# Altium project FPGA_POETIC.PrjPcb (part 2 of 2)
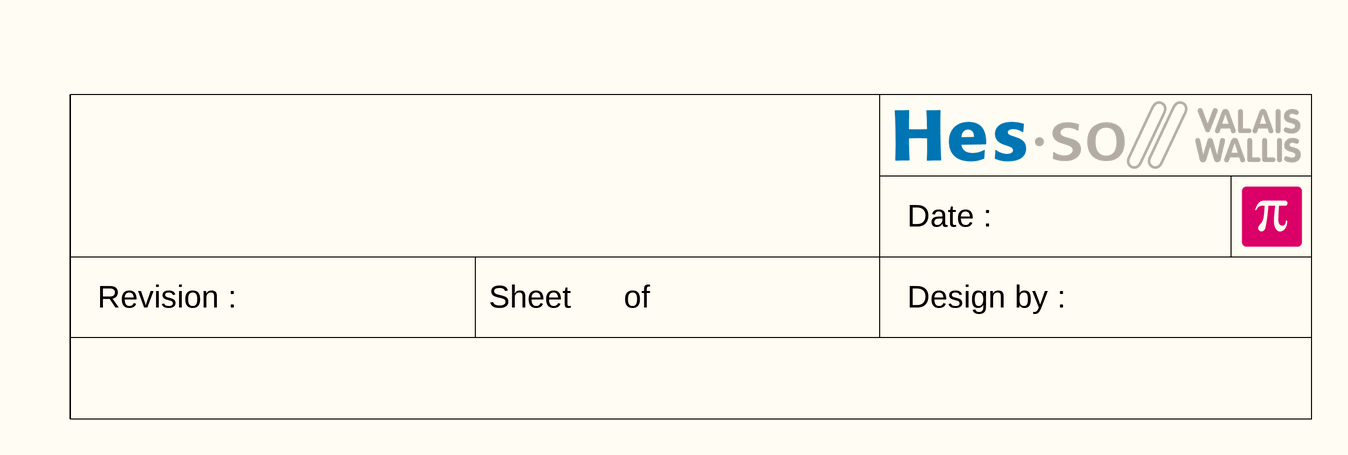
[diagram p10: UserInterface_0.SchDoc, right]

## Nets that join several sheets
+1.2V_CORE: FPGA_1 (31 pins), Supply_0 (R62.2 TP5.1)
+3V3_BACKPLANE: Connector_0 (6 pins), Supply_0 (7 pins)
+3V3_D: FPGA_0 (R26.2 R29.2 R57.2), FPGA_1 (99 pins), Connector_0 (13 pins), Supply_0 (J8.2 TP6.1), UserInterface_0 (7 pins)
+5V_MEZZA: Connector_0 (J2.a25 J11.a25), Supply_0 (J7.2 TP1.1)
+5V_USB: Connector_0 (C79.2 C80.2 R7.2 U1.19), Supply_0 (6 pins)
GND_D: FPGA_0 (R27.1 R28.1 R56.1), FPGA_1 (115 pins), Connector_0 (61 pins), Supply_0 (15 pins), UserInterface_0 (14 pins)
~{SPIA_STE}: FPGA_0 (U2.AB17), Connector_0 (J1.b12 J10.b12)
~{SPIB_STE}: FPGA_0 (U2.AB11), Connector_0 (J1.b8 J10.b8)
~{SPIC_STE}: FPGA_0 (U2.AA4), Connector_0 (J1.b2 J10.b2)
ADC_CH0_CS: FPGA_0 (U2.F15), Connector_0 (J1.b25 J10.b25)
ADC_CH0_SDO: FPGA_0 (U2.H14), Connector_0 (J1.b23 J10.b23)
ADC_CH1_CS: FPGA_0 (U2.A15), Connector_0 (J2.b22 J11.b22)
ADC_CH1_SDO: FPGA_0 (U2.A14), Connector_0 (J2.b21 J11.b21)
ADC_CH2_CS: FPGA_0 (U2.B12), Connector_0 (J2.b20 J11.b20)
ADC_CH2_SDO: FPGA_0 (U2.C17), Connector_0 (J2.b19 J11.b19)
ADC_CH3_CS: FPGA_0 (U2.A18), Connector_0 (J2.b24 J11.b24)
ADC_CH3_SDO: FPGA_0 (U2.B16), Connector_0 (J2.b23 J11.b23)
ADC_CH4_CS: FPGA_0 (U2.C16), Connector_0 (J2.b18 J11.b18)
ADC_CH4_SDO: FPGA_0 (U2.C15), Connector_0 (J2.b16 J11.b16)
ADC_CH5_CS: FPGA_0 (U2.B6), Connector_0 (J2.a3 J11.a3)
ADC_CH5_SDO: FPGA_0 (U2.A4), Connector_0 (J2.a2 J11.a2)
ADC_CH6_CS: FPGA_0 (U2.A8), Connector_0 (J2.a6 J11.a6)
ADC_CH6_SDO: FPGA_0 (U2.A7), Connector_0 (J2.a4 J11.a4)
ADC_CH7_CS: FPGA_0 (U2.C10), Connector_0 (J2.b13 J11.b13)
ADC_CH7_SDO: FPGA_0 (U2.C9), Connector_0 (J2.b11 J11.b11)
ADC_CH8_CS: FPGA_0 (U2.A11), Connector_0 (J2.a8 J11.a8)
ADC_CH8_SDO: FPGA_0 (U2.B10), Connector_0 (J2.a7 J11.a7)
ADC_CH9_CS: FPGA_0 (U2.C8), Connector_0 (J2.b10 J11.b10)
ADC_CH9_SDO: FPGA_0 (U2.C7), Connector_0 (J2.b9 J11.b9)
ADC_CH10_CS: FPGA_0 (U2.C6), Connector_0 (J2.b8 J11.b8)
ADC_CH10_SDO: FPGA_0 (U2.A10), Connector_0 (J2.b7 J11.b7)
ADC_CH11_CS: FPGA_0 (U2.A6), Connector_0 (J2.b3 J11.b3)
ADC_CH11_SDO: FPGA_0 (U2.A5), Connector_0 (J2.b2 J11.b2)
ADC_CH12_CS: FPGA_0 (U2.A9), Connector_0 (J2.b6 J11.b6)
ADC_CH12_SDO: FPGA_0 (U2.B8), Connector_0 (J2.b4 J11.b4)
ADC_CH13_CS: FPGA_0 (U2.C13), Connector_0 (J2.a13 J11.a13)
ADC_CH13_SDO: FPGA_0 (U2.D8), Connector_0 (J2.a11 J11.a11)
ADC_CH14_CS: FPGA_0 (U2.D14), Connector_0 (J2.a16 J11.a16)
ADC_CH14_SDO: FPGA_0 (U2.C14), Connector_0 (J2.a14 J11.a14)
ADC_CH15_CS: FPGA_0 (U2.D7), Connector_0 (J2.a10 J11.a10)
ADC_CH15_SDO: FPGA_0 (U2.D6), Connector_0 (J2.a9 J11.a9)
ADC_CH16_CS: FPGA_0 (U2.A12), Connector_0 (J2.a19 J11.a19)
ADC_CH16_SDO: FPGA_0 (U2.D17), Connector_0 (J2.a18 J11.a18)
ADC_CH17_CS: FPGA_0 (U2.A17), Connector_0 (J2.a23 J11.a23)
ADC_CH17_SDO: FPGA_0 (U2.A16), Connector_0 (J2.a22 J11.a22)
ADC_CH18_CS: FPGA_0 (U2.H13), Connector_0 (J1.b22 J10.b22)
ADC_CH18_SDO: FPGA_0 (U2.F14), Connector_0 (J1.b21 J10.b21)
ADC_CH19_CS: FPGA_0 (U2.B14), Connector_0 (J2.a21 J11.a21)
ADC_CH19_SDO: FPGA_0 (U2.A13), Connector_0 (J2.a20 J11.a20)
ADC_SCLK: FPGA_0 (U2.B18), Connector_0 (J2.a24 J11.a24)
BN_EN: FPGA_0 (U2.P17), Connector_0 (J4.A29)
BN_ERROR_R: FPGA_0 (U2.W20), Connector_0 (J4.C29 R9.1)
BN_ERROR_W: FPGA_0 (U2.V20), Connector_0 (J4.B29 R8.1)
BN_MASTER_RST: FPGA_0 (U2.U19), Connector_0 (J4.C27)
BP_GPIO_0: FPGA_0 (U2.J20), Connector_0 (J4.A14)
BP_GPIO_1: FPGA_0 (U2.K20), Connector_0 (J4.A15)
BP_GPIO_2: FPGA_0 (U2.L20), Connector_0 (J4.A16)
BP_GPIO_3: FPGA_0 (U2.L19), Connector_0 (J4.A17)
BP_GPIO_4: FPGA_0 (U2.M19), Connector_0 (J4.A19)
BP_GPIO_5: FPGA_0 (U2.M20), Connector_0 (J4.A20)
BP_GPIO_6: FPGA_0 (U2.M18), Connector_0 (J4.A21)
BP_GPIO_7: FPGA_0 (U2.F18), Connector_0 (J4.A22)
BP_GPIO_8: FPGA_0 (U2.K19), Connector_0 (J4.A24)
BP_GPIO_9: FPGA_0 (U2.K17), Connector_0 (J4.A25)
BP_GPIO_10: FPGA_0 (U2.M16), Connector_0 (J4.A26)
BP_GPIO_11: FPGA_0 (U2.N16), Connector_0 (J4.A27)
BP_GPIO_13: FPGA_0 (U2.L22), Connector_0 (J4.B14)
BP_GPIO_14: FPGA_0 (U2.M21), Connector_0 (J4.B15)
BP_GPIO_15: FPGA_0 (U2.P20), Connector_0 (J4.B16)
BP_GPIO_16: FPGA_0 (U2.T22), Connector_0 (J4.B17)
BP_GPIO_17: FPGA_0 (U2.T21), Connector_0 (J4.B19)
BP_GPIO_18: FPGA_0 (U2.V22), Connector_0 (J4.B20)
BP_GPIO_19: FPGA_0 (U2.W22), Connector_0 (J4.B21)
BP_GPIO_20: FPGA_0 (U2.G16), Connector_0 (J4.B22)
BP_GPIO_21: FPGA_0 (U2.H16), Connector_0 (J4.B24)
BP_GPIO_22: FPGA_0 (U2.P19), Connector_0 (J4.B25)
BP_GPIO_23: FPGA_0 (U2.R19), Connector_0 (J4.B26)
BP_GPIO_24: FPGA_0 (U2.U20), Connector_0 (J4.B27)
BP_GPIO_26: FPGA_0 (U2.K22), Connector_0 (J4.C14)
BP_GPIO_27: FPGA_0 (U2.M22), Connector_0 (J4.C15)
BP_GPIO_28: FPGA_0 (U2.P22), Connector_0 (J4.C16)
BP_GPIO_29: FPGA_0 (U2.R22), Connector_0 (J4.C17)
BP_GPIO_30: FPGA_0 (U2.U22), Connector_0 (J4.C19)
BP_GPIO_31: FPGA_0 (U2.V21), Connector_0 (J4.C20)
BP_GPIO_32: FPGA_0 (U2.F17), Connector_0 (J4.C21)
BP_GPIO_33: FPGA_0 (U2.G17), Connector_0 (J4.C22)
BP_GPIO_34: FPGA_0 (U2.N19), Connector_0 (J4.C24)
BP_GPIO_35: FPGA_0 (U2.R20), Connector_0 (J4.C25)
BP_GPIO_36: FPGA_0 (U2.T19), Connector_0 (J4.C26)
BP_PWM1A: FPGA_0 (U2.C19), Connector_0 (J4.A2)
BP_PWM1B: FPGA_0 (U2.C20), Connector_0 (J4.A3)
BP_PWM2A: FPGA_0 (U2.D19), Connector_0 (J4.A5)
BP_PWM2B: FPGA_0 (U2.D20), Connector_0 (J4.A6)
BP_PWM3A: FPGA_0 (U2.E20), Connector_0 (J4.A8)
BP_PWM3B: FPGA_0 (U2.F20), Connector_0 (J4.A9)
BP_PWM4A: FPGA_0 (U2.G20), Connector_0 (J4.A11)
BP_PWM4B: FPGA_0 (U2.H20), Connector_0 (J4.A12)
BP_PWM5A: FPGA_0 (U2.B20), Connector_0 (J4.B2)
BP_PWM5B: FPGA_0 (U2.B21), Connector_0 (J4.B3)
BP_PWM6A: FPGA_0 (U2.C22), Connector_0 (J4.B5)
BP_PWM6B: FPGA_0 (U2.D22), Connector_0 (J4.B6)
BP_PWM7A: FPGA_0 (U2.F21), Connector_0 (J4.B8)
BP_PWM7B: FPGA_0 (U2.G22), Connector_0 (J4.B9)
BP_PWM8A: FPGA_0 (U2.H22), Connector_0 (J4.B11)
BP_PWM8B: FPGA_0 (U2.K21), Connector_0 (J4.B12)
BP_PWM9A: FPGA_0 (U2.A20), Connector_0 (J4.C2)
BP_PWM9B: FPGA_0 (U2.A21), Connector_0 (J4.C3)
BP_PWM10A: FPGA_0 (U2.B22), Connector_0 (J4.C5)
BP_PWM10B: FPGA_0 (U2.D21), Connector_0 (J4.C6)
BP_PWM11A: FPGA_0 (U2.E22), Connector_0 (J4.C8)
BP_PWM11B: FPGA_0 (U2.F22), Connector_0 (J4.C9)
BP_PWM12A: FPGA_0 (U2.H21), Connector_0 (J4.C11)
BP_PWM12B_BN_PWM: FPGA_0 (U2.J22), Connector_0 (J4.C12)
CLK_100MHz: FPGA_0 (U2.J1), FPGA_1 (X2.3)
DIL_0: FPGA_0 (U2.B1), UserInterface_0 (S6.2)
DIL_1: FPGA_0 (U2.B2), UserInterface_0 (S6.4)
DIL_2: FPGA_0 (U2.A2), UserInterface_0 (S6.6)
DIL_3: FPGA_0 (U2.B3), UserInterface_0 (S6.8)
FLASH_SPI_CLK: FPGA_0 (U2.AA21), FPGA_1 (R33.1 R38.2 U3.6)
FLASH_SPI_CS_N: FPGA_0 (U2.AB20), FPGA_1 (R31.1 U3.1)
FLASH_SPI_DI: FPGA_0 (U2.AA20), FPGA_1 (U3.2)
FLASH_SPI_DO: FPGA_0 (U2.AB21), FPGA_1 (U3.5)
FPGA_JTAG_TCK: FPGA_1 (U2.G15), Connector_0 (J3.5 R3.1)
FPGA_JTAG_TDI: FPGA_1 (U2.E18), Connector_0 (J3.9 R1.1)
FPGA_JTAG_TDO: FPGA_1 (U2.A19), Connector_0 (J3.7 R2.1)
FPGA_JTAG_TMS: FPGA_1 (U2.C18), Connector_0 (J3.3 R4.1)
LED1_0_GREEN: FPGA_0 (U2.H3), UserInterface_0 (R41.1)
LED1_0_RED: FPGA_0 (U2.E4), UserInterface_0 (LD4.8)
LED1_1_GREEN: FPGA_0 (U2.J3), UserInterface_0 (R43.1)
LED1_1_RED: FPGA_0 (U2.E5), UserInterface_0 (LD4.6)
LED1_2_GREEN: FPGA_0 (U2.G3), UserInterface_0 (R45.1)
LED1_2_RED: FPGA_0 (U2.D1), UserInterface_0 (LD4.4)
LED1_3_GREEN: FPGA_0 (U2.F3), UserInterface_0 (R47.1)
LED1_3_RED: FPGA_0 (U2.C1), UserInterface_0 (LD4.2)
LED2_0_GREEN: FPGA_0 (U2.R4), UserInterface_0 (R42.1)
LED2_0_RED: FPGA_0 (U2.N3), UserInterface_0 (LD5.8)
LED2_1_GREEN: FPGA_0 (U2.U4), UserInterface_0 (R44.1)
LED2_1_RED: FPGA_0 (U2.M3), UserInterface_0 (LD5.6)
LED2_2_GREEN: FPGA_0 (U2.P4), UserInterface_0 (R46.1)
LED2_2_RED: FPGA_0 (U2.L3), UserInterface_0 (LD5.4)
LED2_3_GREEN: FPGA_0 (U2.P6), UserInterface_0 (R48.1)
LED2_3_RED: FPGA_0 (U2.K3), UserInterface_0 (LD5.2)
Push_BT_0: FPGA_0 (U2.C4), UserInterface_0 (C31.2 R51.1 S3.2)
Push_BT_1: FPGA_0 (U2.C3), UserInterface_0 (C29.2 R49.1 S4.2)
Push_BT_2: FPGA_0 (U2.D3), UserInterface_0 (C30.2 R50.1 S5.2)
SCIC_RX: FPGA_0 (U2.AB18), Connector_0 (J1.a12 J10.a12)
SCIC_TX: FPGA_0 (U2.AA16), Connector_0 (J1.a11 J10.a11)
SOFTRESET_N: FPGA_0 (U2.D5), FPGA_1 (C34.2 R36.1 S2.2)
Spare_0: FPGA_0 (U2.AB4), Connector_0 (J1.a2 J10.a2), UserInterface_0 (JP1.2)
Spare_1: FPGA_0 (U2.AB6), Connector_0 (J1.a3 J10.a3), UserInterface_0 (JP2.2)
Spare_2: FPGA_0 (U2.AA8), Connector_0 (J1.a4 J10.a4), UserInterface_0 (JP3.2)
Spare_3: FPGA_0 (U2.AB9), Connector_0 (J1.a5 J10.a5), UserInterface_0 (JP4.2)
Spare_4: FPGA_0 (U2.AB10), Connector_0 (J1.a6 J10.a6)
Spare_5: FPGA_0 (U2.AB14), Connector_0 (J1.a8 J10.a8)
Spare_6: FPGA_0 (U2.AB15), Connector_0 (J1.a9 J10.a9)
SPIA_CLK: FPGA_0 (U2.AB19), Connector_0 (J1.b13 J10.b13)
SPIA_SIMO: FPGA_0 (U2.AB16), Connector_0 (J1.b11 J10.b11)
SPIB_CLK: FPGA_0 (U2.AA10), Connector_0 (J1.b6 J10.b6)
SPIB_SIMO: FPGA_0 (U2.AA14), Connector_0 (J1.b9 J10.b9)
SPIC_CLK: FPGA_0 (U2.AA6), Connector_0 (J1.b3 J10.b3)
SPIC_SIMO: FPGA_0 (U2.AB7), Connector_0 (J1.b4 J10.b4)
SPIC_SOMI: FPGA_0 (U2.AB8), Connector_0 (J1.b5 J10.b5)
USB_~{CTS}: FPGA_0 (U2.V2), Connector_0 (U1.8)
USB_~{RTS}: FPGA_0 (U2.Y1), Connector_0 (U1.32)
USB_RXD: FPGA_0 (U2.W1), Connector_0 (U1.2)
USB_TXD: FPGA_0 (U2.Y2), Connector_0 (U1.30)